# Altium schematic sheet SCH2.SchDoc
size A4; SheetNumber: 2; SheetTotal: 2
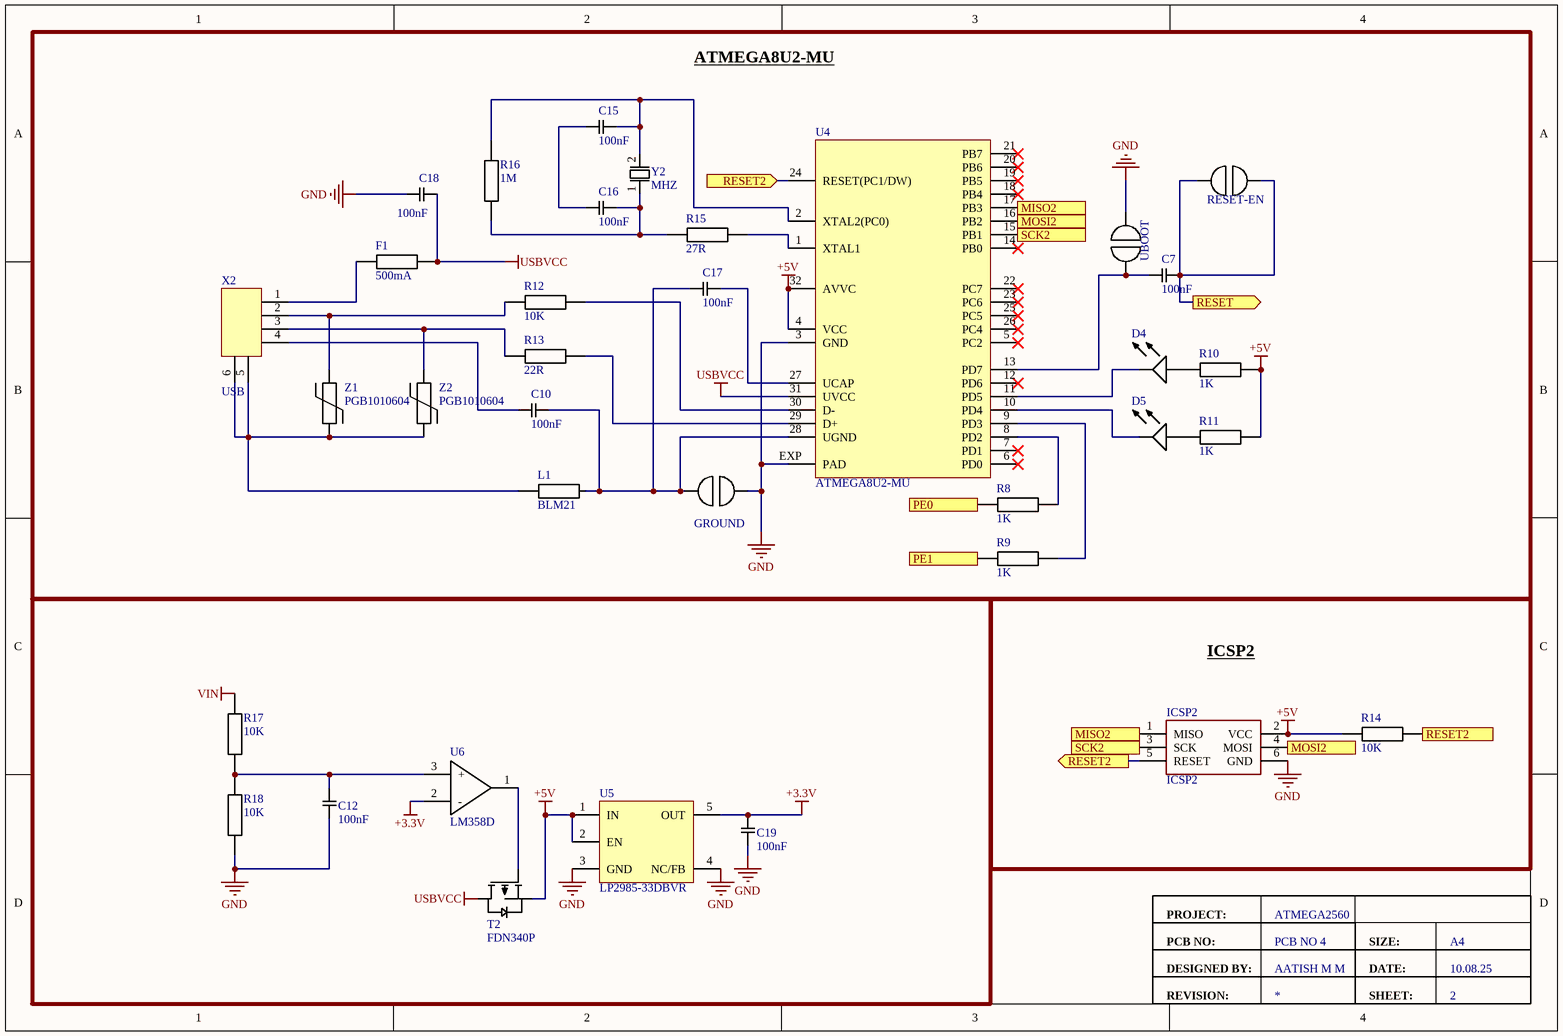
[diagram p0: SCH2.SchDoc]

## Parts
C7  100nF  [CAPACITOR]
C10  100nF  [CAPACITOR]
C12  100nF  [CAPACITOR]
C15  100nF  [CAPACITOR]
C16  100nF  [CAPACITOR]
C17  100nF  [CAPACITOR]
C18  100nF  [CAPACITOR]
C19  100nF  [CAPACITOR]
D4  C  [LED]  (value not drawn)
D5  C  [LED]  (value not drawn)
F1  500mA  [FUSE]
ICSP2  ICSP2  [ICSP]
L1  BLM21  [BLM21BD102SN1D]
R8  1K  [RESISTOR]
R9  1K  [RESISTOR]
R10  1K  [RESISTOR]
R11  1K  [RESISTOR]
R12  10K  [RESISTOR]
R13  22R  [RESISTOR]
R14  10K  [RESISTOR]
R15  27R  [RESISTOR]
R16  1M  [RESISTOR]
R17  10K  [RESISTOR]
R18  10K  [RESISTOR]
S1  GROUND  [2 pin header]
S2  UBOOT  [2 pin header]
S3  RESET-EN  [2 pin header]
T2  FDN340P  [FDN340P]
U4  ATMEGA8U2-MU  [ATMEGA8U2-MU]
U5  LP2985-33DBVR  [LP2985-33DBVR]
U6  LM358D  [LM258D]
X2  USB  [UJ2-BH-1-TH]
Y2  MHZ  [ECS-160-20-5PX-TR]
Z1  PGB1010604  [PGB1010603MR]
Z2  PGB1010604  [PGB1010603MR]

## Ports
MISO2 (in, see SCH2[3C]), MISO2 (out, see SCH2[3A]), MOSI2 (in, see SCH2[4C]), MOSI2 (out, see SCH2[3A]), PE0 (in, see SCH1[2C], SCH1[3B]), PE1 (in, see SCH1[2C], SCH1[3B]), RESET2 (in, see SCH2[3C], SCH2[4C]), RESET2 (out, see SCH2[2A], SCH2[3C]), RESET2 (out, see SCH2[2A], SCH2[4C]), RESET (out, see SCH1[1A], SCH1[4A], SCH1[4B]), SCK2 (in, see SCH2[3C]), SCK2 (out, see SCH2[3A])

## Nets
+3.3V: C19.2 U5.5(OUT) U6.2(-)
+5V: ICSP2.2(VCC) R10.2 R11.2 R14.1 T2.3 U4.4(VCC) U4.32(AVVC) U5.1(IN) U5.2(EN)
GND: C12.1 C18.2 C19.1 ICSP2.6(GND) R18.1 S1.2 S2.2 U4.3(GND) U4.EXP(PAD) U5.3(GND) U5.4(NC/FB)
USBVCC: C18.1 F1.2 T2.1 U4.31(UVCC)
VIN: R17.2
MISO2: ICSP2.1(MISO) U4.17(PB3) ; port MISO2
MOSI2: ICSP2.4(MOSI) U4.16(PB2) ; port MOSI2
PE0: R8.1 ; port PE0
PE1: R9.1 ; port PE1
RESET: C7.2 S3.1 S3.2 ; port RESET
RESET2: ICSP2.5(RESET) R14.2 U4.24(RESET(PC1/DW)) ; port RESET2
SCK2: ICSP2.3(SCK) U4.15(PB1) ; port SCK2
NetC7_1: C7.1 S2.1 U4.13(PD7)
NetC10_1: C10.1 X2.4
NetC10_2: C10.2 C17.1 L1.2 S1.1 U4.28(UGND)
NetC12_2: C12.2 R17.1 R18.2 U6.3(+)
NetC15_1: C15.1 C16.1
NetC15_2: C15.2 R16.2 U4.2(XTAL2(PC0)) Y2.2
NetC16_2: C16.2 R15.1 R16.1 Y2.1
NetC17_2: C17.2 U4.27(UCAP)
NetD4_1: D4.1 R10.1
NetD4_2: D4.2 U4.11(PD5)
NetD5_1: D5.1 R11.1
NetD5_2: D5.2 U4.10(PD4)
NetF1_1: F1.1 X2.1
NetL1_1: L1.1 X2.5 X2.6 Z1.1 Z2.1
NetR8_2: R8.2 U4.8(PD2)
NetR9_2: R9.2 U4.9(PD3)
NetR12_1: R12.1 X2.2 Z1.2
NetR12_2: R12.2 U4.30(D-)
NetR13_1: R13.1 X2.3 Z2.2
NetR13_2: R13.2 U4.29(D+)
NetR15_2: R15.2 U4.1(XTAL1)
NetT2_2: T2.2 U6.1

Not connected (* = marked no-connect by the designer): U4 5(PC2)* 6(PD0)* 7(PD1)* 12(PD6)* 14(PB0)* 18(PB4)* 19(PB5)* 20(PB6)* 21(PB7)* 22(PC7)* 23(PC6)* 25(PC5)* 26(PC4)*

## Notes on the sheet
- ATMEGA8U2-MU
- ICSP2
- PROJECT:
- ATMEGA2560
- PCB NO:
- DESIGNED BY:
- PCB NO 4
- AATISH M M
- SIZE:
- DATE:
- A4
- 10.08.25
- REVISION:
- SHEET:

## Library data of the parts
C7 C10 C12 C15-C19 = CAPACITOR
D4 D5 = LED
F1 L1 R8-R18 = RESISTOR
ICSP2 = ICSP
S1-S3 = PUSH
U6 = OP AMP
Y2 = XTAL
Z1 Z2 = TRIODE